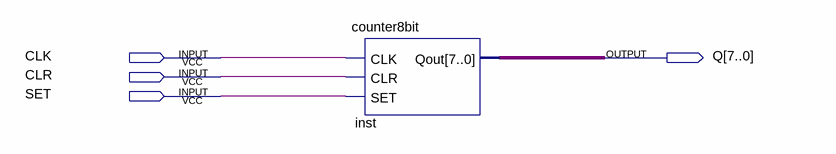
[diagram p0: schematic sheet]
// Quartus schematic counter.bdf as structural Verilog: 1 symbols, 4 pins
module counter (
  input  CLK,
  input  CLR,
  input  SET,
  output [7:0] Q
);

  counter8bit inst (.CLK(CLK), .CLR(CLR), .SET(SET), .Qout(Q));
endmodule
